# Altium schematic sheet plc_module_xs.00001.001_Power.SchDoc: =GlobalProjectName
size 410 x 297 mm; ApprovedBy: Утвердил; CheckedBy: Проверил; Author: Разработал; SheetNumber: Лист; SheetTotal: Листов; PageSetup: Record=PageOptions|CenterHorizontal=True|CenterVertical=True|PrintScale=1.00|XCorrection=1.00|YCorrection=1.00|PrintKind=1|BorderSize=5000000|LeftOffset=0|BottomOffset=0|Orientation=2|PaperLength=1000|PaperWidth=1000|Scale=100|PaperSource=15|PrintQuality=1200|MediaType=1|DitherType=10|PaperKind=A3|PrintScaleMode=1; Weight: -; ScaleFactor: -; NormInspection: Норм.Контр.
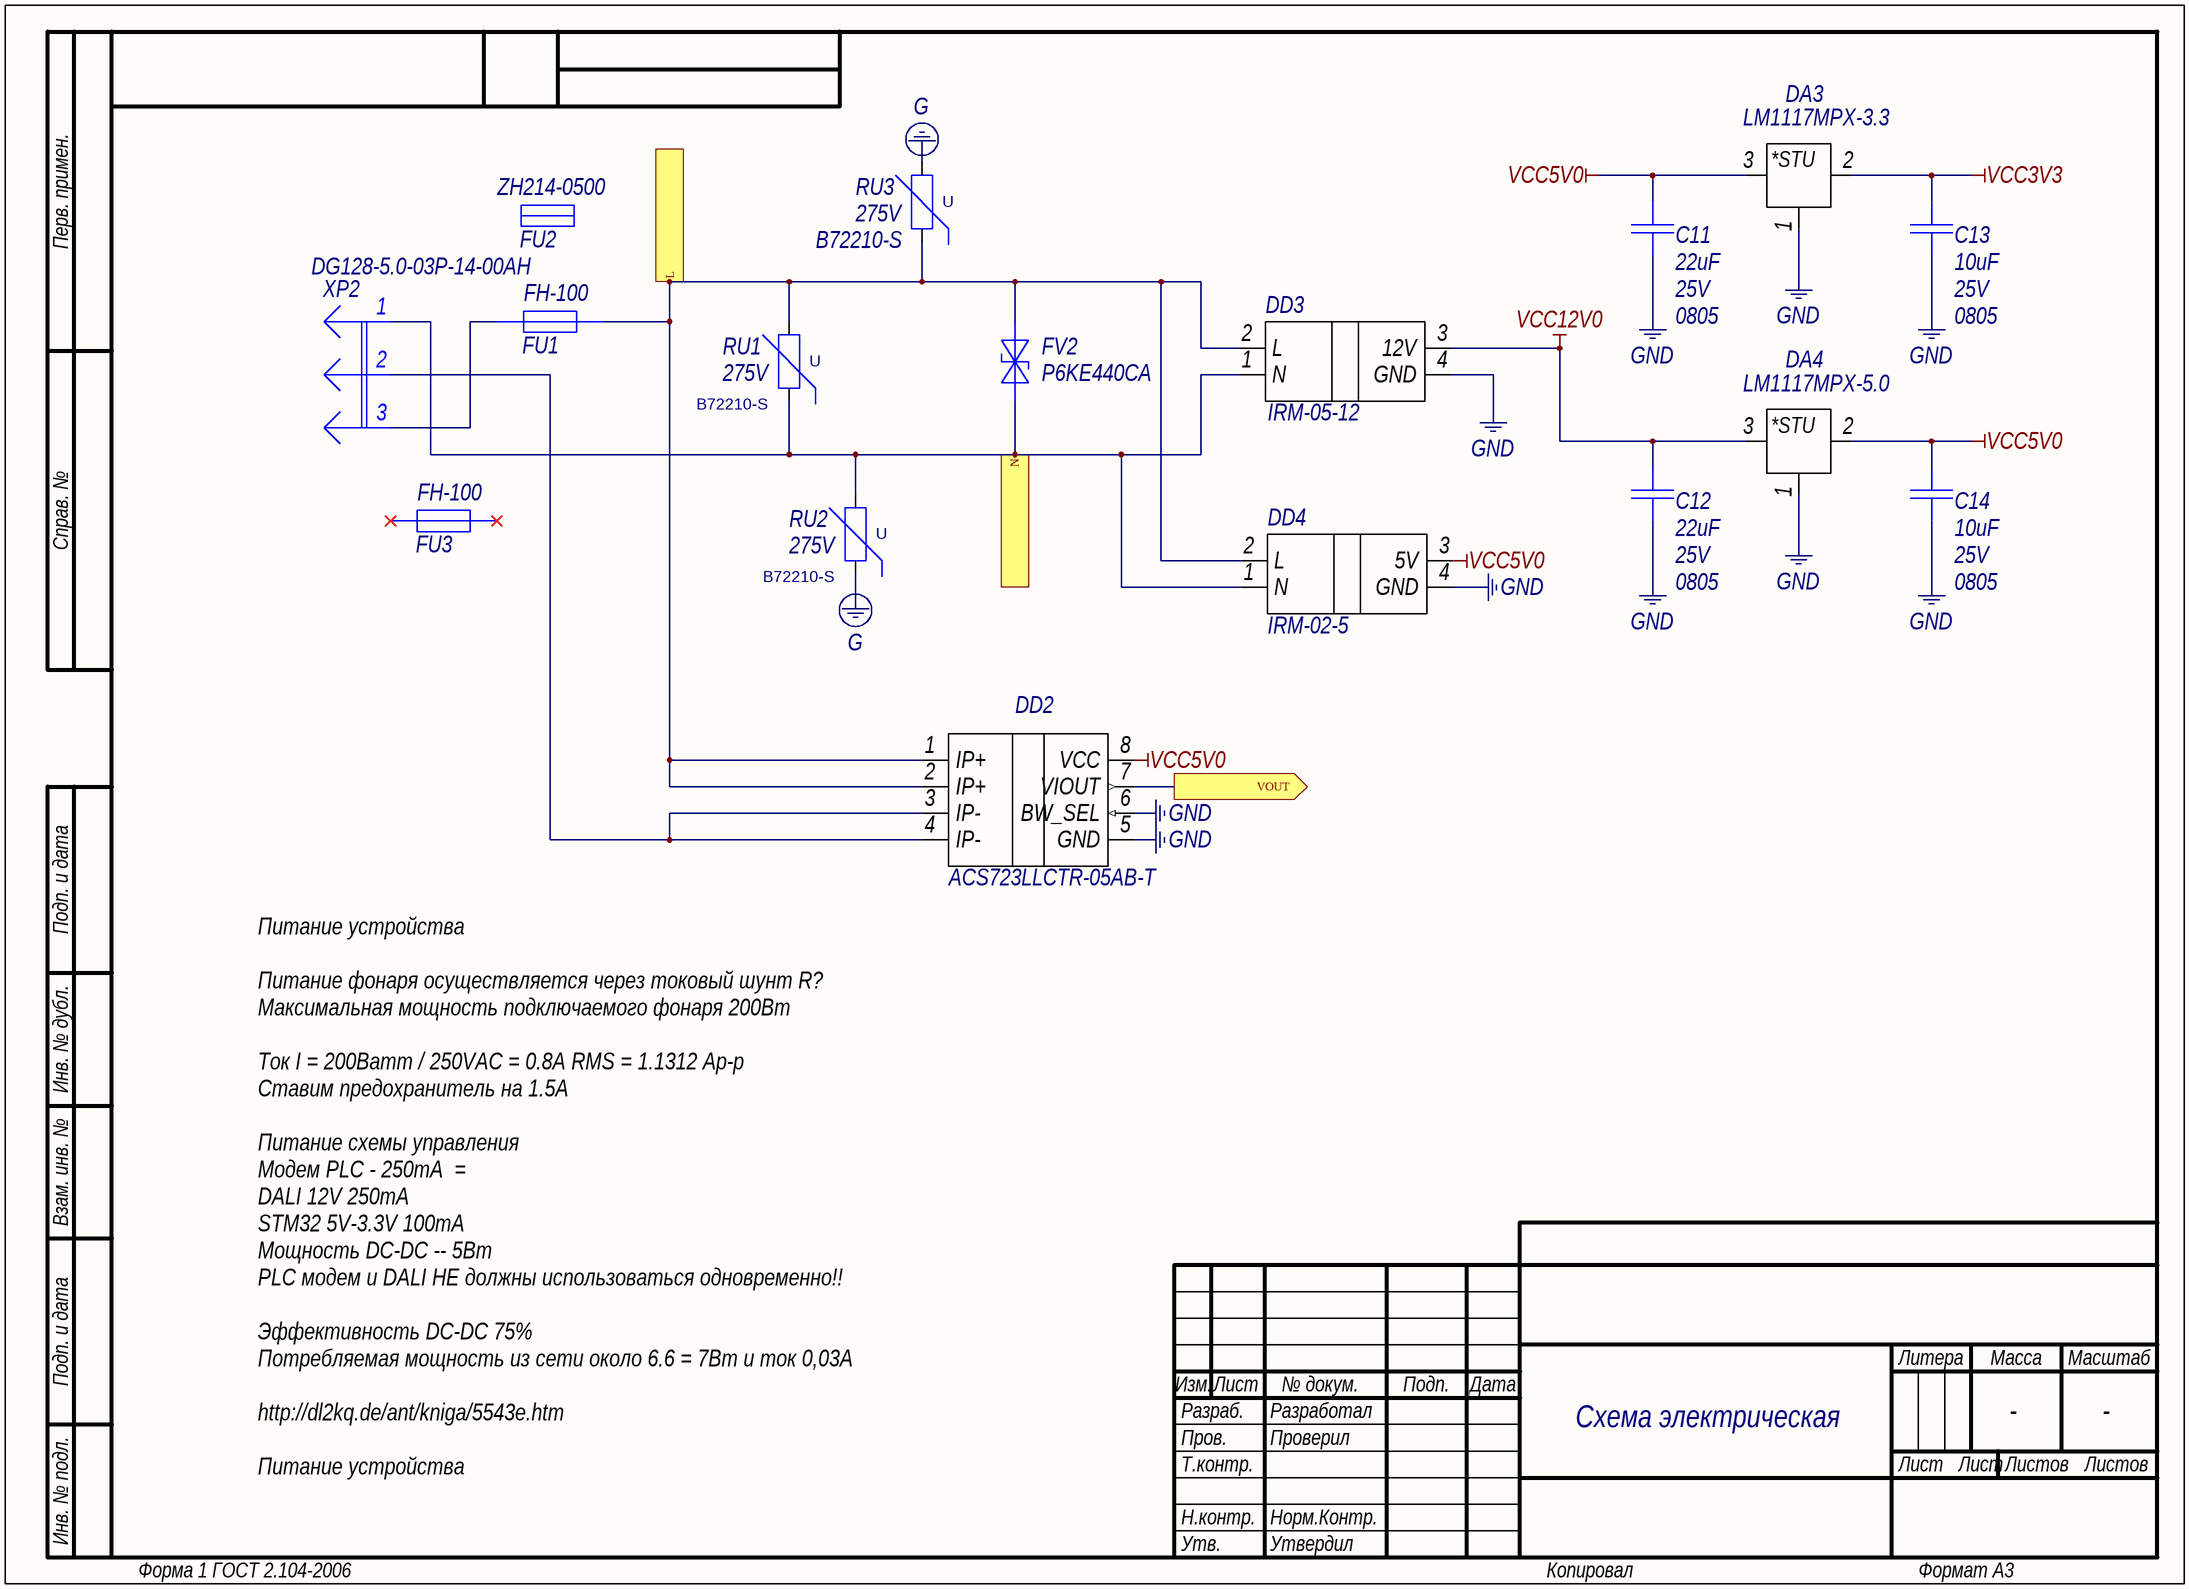
[diagram p0: plc_module_xs.00001.001_Power.SchDoc]

## Parts
C11  Voltage: 25V  Footprint: 0805  [C0805]  (hidden comment: 22uF)
C12  Voltage: 25V  Footprint: 0805  [C0805]  (hidden comment: 22uF)
C13  Voltage: 25V  Footprint: 0805  [C0805]  (hidden comment: 10uF)
C14  Voltage: 25V  Footprint: 0805  [C0805]  (hidden comment: 10uF)
DA3  value LM1117MPX-3.3  [SOT-223]  (hidden comment: LM1117-Series)
DA4  value LM1117MPX-5.0  [SOT-223]  (hidden comment: LM1117-Series)
DD2  ACS723LLCTR-05AB-T  [SOIC-8]
DD3  IRM-05-12  [IRM-05-12]
DD4  IRM-02-5  [IRM-02-5]
FU1  value FH-100  [F-W20.0/E5.0]  (hidden comment: Fuse)
FU2  ZH214-0500  [FUSE_SCHURTER_FSF5X20]  (mechanical)
FU3  value FH-100  [F-W20.0/E5.0]  (hidden comment: Fuse)  (mechanical)
FV2  P6KE440CA  [DO-15]
RU1  B72210-S  Max Continuous voltage (RMS): 275V  [VAR_EPCOS_B72210S0461K101]
RU2  B72210-S  Max Continuous voltage (RMS): 275V  [VAR_EPCOS_B72210S0461K101]
RU3  B72210-S  Max Continuous voltage (RMS): 275V  [VAR_EPCOS_B72210S0461K101]
XP2  value DG128-5.0-03P-14-00AH  [PHOENIX_1715734]  (hidden comment: LIN LOUT N)

## Ports
L, N, VOUT (out)

## Nets
G: RU2.2 RU3.1
GND: C11.1 C12.1 C13.1 C14.1 DA3.1(Adj/GND) DA4.1(Adj/GND) DD2.5(GND) DD2.6(BW_SEL) DD3.4(GND) DD4.4(GND)
VCC3V3: C13.2 DA3.2(Out)
VCC5V0: C11.2 C14.2 DA3.3(In) DA4.2(Out) DD2.8(VCC) DD4.3(5V)
VCC12V0: C12.2 DA4.3(In) DD3.3(12V)
L: DD2.1(IP+) DD2.2(IP+) DD3.2(L) DD4.2(L) FU1.2 FV2.2(К) RU1.1 RU3.2 ; port L
N: DD3.1(N) DD4.1(N) FV2.1(А) RU1.2 RU2.1 XP2.1 ; port N
VOUT: DD2.7(VIOUT) ; port VOUT
NetDD2_3: DD2.3(IP-) DD2.4(IP-) XP2.2
NetFU1_1: FU1.1 XP2.3

Not connected (* = marked no-connect by the designer): FU3 1* 2*

## Notes on the sheet
- Схема электрическая
  принципиальная
- Питание устройства
  Питание фонаря осуществляется через токовый шунт R?
  Максимальная мощность подключаемого фонаря 200Вт
  Ток I = 200Ватт / 250VAC = 0.8A RMS = 1.1312 Аp-p
  Ставим предохранитель на 1.5A
  Питание схемы управления
  Модем PLC - 250mA  =
  DALI 12V 250mA
  STM32 5V-3.3V 100mA
  Мощность DC-DC -- 5Вт
  PLC модем и DALI НЕ должны использоваться одновременно!!
  Эффективность DC-DC 75%
  Потребляемая мощность из сети около 6.6 = 7Вт и ток 0,03А
  http://dl2kq.de/ant/kniga/5543e.htm
  Питание устройства
  Питание фонаря осуществляется через токовый шунт R?
  Максимальная мощность подключаемого фонаря 200Вт
  Ток I = 200Ватт / 250VAC = 0.8A RMS = 1.1312 Аp-p
  Ставим предохранитель на 1.5A
  Максимальный ток через шунт пусть будет 3А
  Ток насыщения датчика тока 1.2А
  MAX4372F — 50V/V
  т.е. при питании от 5В напряжение насыщения на шунте будет
  50 * Uшунт  = 5В
  Uшунт = 1/10 В = 100мВ
  Сопротивление шунта 0.1 / 1.2 = 0.083 Ом
  При токе в 3А мощность шунта 0,083 * 3 * 3 = 0,747Вт
  В наличии есть шунт 100мОм, 1Вт
  При токе в 1.2А напряжение на резисторе будет 0,1 * 1,2 = 0,12В
  На выходе услилтеля будет 6В -- насыщение
  Максимальный ток до насыщения - 1А
- Перв. примен.
- Справ. №
- Подп. и дата
- Инв. № дубл.
- Взам. инв. №
- Разраб.
- Изм.
- Лист
- № докум.
- Подп.
- Дата
- Литера
- Масса
- Масштаб
- Пров.
- Т.контр.
- Листов
- Инв. № подл.
- Н.контр.
- Утв.
- Форма 1 ГОСТ 2.104-2006
- Копировал
- Формат А3
- (in symbol B72210-S 271-K101) U
- (in symbol LM1117MPX-3.3) *STU
- (in symbol LM1117MPX-5.0) *STU

## Library data of the parts
C11 C12 = GRM21BR61E226ME44L: Manufacturer: Murata; Type: Конденсатор; ID: 39; Tolerance: ±20%; Dielectric Type: X5R; Published: 18.05.2010; Publisher: Andrew Danich; Part Number: GRM21BR61E226ME44L; Value: 22uF
C13 C14 = GRM21BR61E106KA73L: Manufacturer: Murata; Type: Конденсатор; ID: 53; Tolerance: ±10%; Dielectric Type: X5R; Published: 18.05.2010; Publisher: Andrew Danich; Part Number: GRM21BR61E106KA73L; Value: 10uF
DA3 = LM1117MPX-3.3: ID: 9; Input Voltage: +8.5…20V; Output Current: 800mA; Output Voltage: +3.3V; Published: 13.08.2015; Publisher: Andrew Danich; Type: Микросхема; Part Number: LM1117MPX-3.3
DA4 = LM1117MPX-5.0: ID: 16; Input Voltage: +8.5…20V; Output Current: 800mA; Output Voltage: +3.3V; URL1: <div><a href="https://www.terraelectronica.ru/product/133540">https://www.terraelectronica.ru/product/133540</a></div>; Published: 13.08.2015; Publisher: Andrew Danich; Type: Микросхема; Part Number: LM1117MPX-5.0; Distributor1: terraelectronica; Distributor2: chipdip; URL2: https://www.chipdip.ru/product/lm1117mpx-5.0-nopb
DD2 = ACS723LLCTR-05AB-T: ID: 6; Published: 13.08.2015; Publisher: Andrew Danich; Type: Микросхема; Part Number: ACS723LLCTR-05AB-T
DD3 = IRM-05-12: Manufacturer: Mean Well (MW); ID: 2; Input Voltage: +12V; Output Current: 420mA; Power: 5W; Working Temperature Min: -30C; Working Temperature Max: +70C; URL1: <div><a href="https://www.terraelectronica.ru/product/1202359">https://www.terraelectronica.ru/product/1202359</a></div>; Part Number: IRM-05-12; Value: IRM-05-12; Output Voltage: +12V; Distributor1: Terraelectronica
DD4 = IRM-02-5: Manufacturer: Mean Well (MW); ID: 17; Output Current: 400mA; Output Voltage: +5V; Power: 2W; Voltage Tolerance: ±2,5%; Working Temperature Min: -30C; Working Temperature Max: +70C; URL1: <div><a href="https://www.terraelectronica.ru/product/2118699">https://www.terraelectronica.ru/product/2118699</a></div>; Part Number: IRM-02-5; Value: IRM-02-5; Distributor1: Terraelectronica
FU1 FU3 = FH-100: ID: 17; Published: 24.09.2010; Publisher: Andrew Danich; Type: Вставка плавкая; Part Number: FH-100; Footprint: 20x5mm
FU2 = ZH214-0500: Manufacturer: Zhenhui; ID: 16; Limit Voltage: 250V; Rated Current: 0.5A; Published: 24.09.2010; Publisher: Andrew Danich; Value: ZH214-0500; Type: Вставка плавкая; Part Number: ZH214-0500; Footprint: 20x5mm
FV2 = P6KE440CA: ID: 16; Reverse Voltage: 376V; Reverse Current: 100A; Total Power Dissipation: 600W; Published: 27.07.2015; Publisher: Andrew Danich; Type: Супрессор; Part Number: P6KE440CA; Value: P6KE440CA; Distributor1: Terraelectronica; Distributor2: ChipDip; Distributor3: Compel
RU1-RU3 = B72210-S 271-K101: ID: 4; Value: S10K275; Varistor voltage at 1mA: 430V; Absorption energy: 43J; Max non-repetitve surge current: 2500A; URL1: <div><a href="https://www.chipdip.ru/product/b72210-s271-k101">https://www.chipdip.ru/product/b72210-s271-k101</a></div>; Part Number: B72210-S 271-K101; Distributor1: chipdip; Distributor2: terraelectronica
XP2 = DG128-5.0-03P-14-00AH: ID: 96; Limit Voltage: 300V; Limit Current: 10A; Connector Type: Female; Resistance: 20mohm; Pitch: 5mm; Working Temperature Min: -40°С; Working Temperature Max: +105°С; Published: 07.03.2013; Publisher: Andrew Danich; Type: Вилка; Part Number: DG128-5.0-03P-14-00AH; Pins: 2